# EasyEDA schematic 1-Schematic_EMWAVER_V1.1.json
TITLE: Sheet_1; REV: 1.0; Date: 2022-12-25; Sheet: 1/1; Drawn By: maarnotto; Company: Your Company
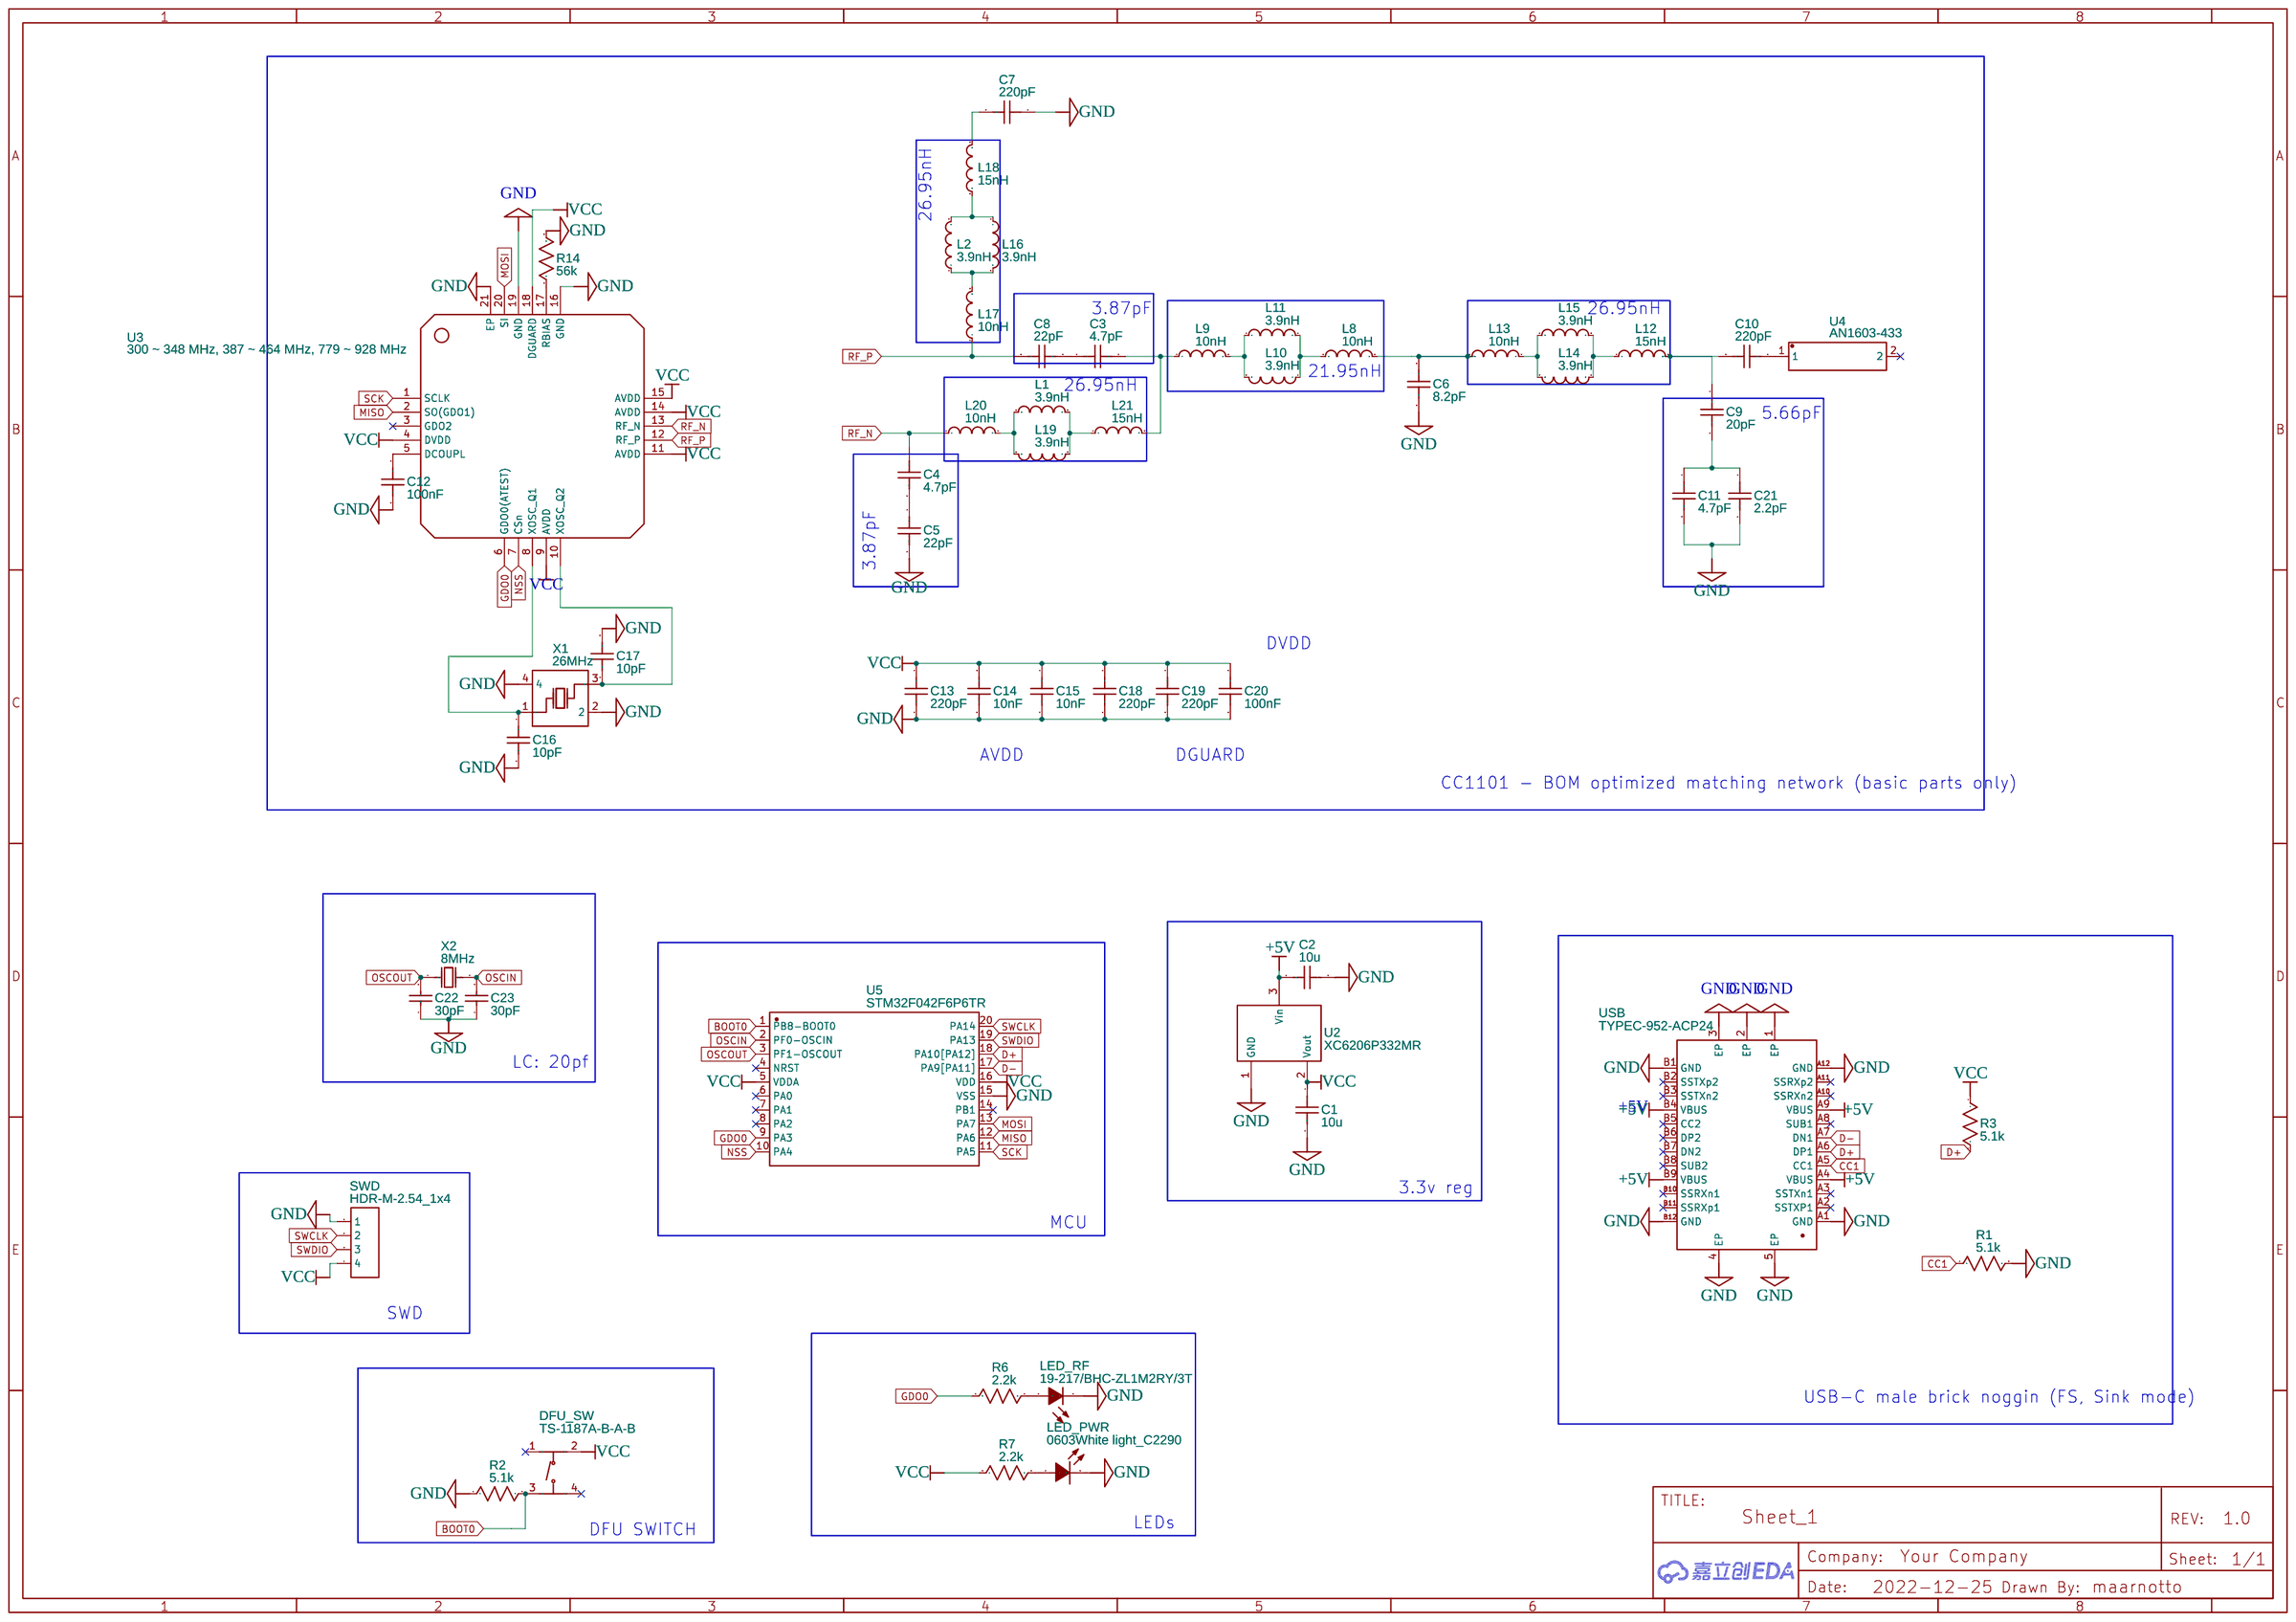
[diagram p0: schematic sheet]

## Parts
C1  10u  [C0603]
C2  10u  [C0603]
C3  4.7pF  [C0402]
C4  4.7pF  [C0402]
C5  22pF  [C0402]
C6  8.2pF  [C0603]
C7  220pF  [C0402]
C8  22pF  [C0402]
C9  20pF  [C0402]
C10  220pF  [C0402]
C11  4.7pF  [C0402]
C12  100nF  [C0402]
C13  220pF  [C0402]
C14  10nF  [C0402]
C15  10nF  [C0402]
C16  10pF  [C0402]
C17  10pF  [C0402]
C18  220pF  [C0402]
C19  220pF  [C0402]
C20  100nF  [C0402]
C21  2.2pF  [C0402]
C22  30pF  [C0603]
C23  30pF  [C0603]
DFU_SW  TS-1187A-B-A-B  [SW-SMD_4P-L5.1-W5.1-P3.70-LS6.5-TL-2]
L1  3.9nH  [L0402]
L2  3.9nH  [L0402]
L8  10nH  [L0402]
L9  10nH  [L0402]
L10  3.9nH  [L0402]
L11  3.9nH  [L0402]
L12  15nH  [L0402]
L13  10nH  [L0402]
L14  3.9nH  [L0402]
L15  3.9nH  [L0402]
L16  3.9nH  [L0402]
L17  10nH  [L0402]
L18  15nH  [L0402]
L19  3.9nH  [L0402]
L20  10nH  [L0402]
L21  15nH  [L0402]
LED_PWR  0603White light_C2290  [LED0603-R-RD_WHITE]
LED_RF  19-217/BHC-ZL1M2RY/3T  [LED0603-RD]
R1  5.1k  [R0603]
R2  5.1k  [R0603]
R3  5.1k  [R0603]
R6  2.2k  [R0603]
R7  2.2k  [R0603]
R14  56k  [R0402]
SWD  HDR-M-2.54_1x4  [HDR-M-2.54_1X4]
U2  XC6206P332MR  [SOT-23-3_L2.9-W1.6-P1.90-LS2.8-BR]
U3  300 ~ 348 MHz, 387 ~ 464 MHz, 779 ~ 928 MHz  [QFN-20_L4.0-W4.0-P0.5-TL-EP]
U4  AN1603-433  [ANT-SMD_L16.0-W3.1]
U5  STM32F042F6P6TR  [TSSOP-20_L6.5-W4.4-P0.65-LS6.4-BL]
USB  TYPEC-952-ACP24  [USB-C-SMD_TYPEC-952-ACP24]
X1  26MHz  [CRYSTAL-SMD_4P-L3.2-W2.5-BL]
X2  8MHz  [CRYSTAL-SMD_L5.0-W3.2]

## Library data of the parts
C1 C2 C6 = C_0603_US: Contributor: LCEDA_Lib
C3-C5 C7-C21 = C_0402_US: Contributor: LCEDA_Lib
C22 C23 = 0603CG300J500NT: Supplier: LCSC; Manufacturer: FH(风华); Supplier Part: C1658; JLCPCB Part Class: Basic Part
DFU_SW = TS-1187A-B-A-B: Supplier: LCSC; Supplier Part: C318884; Manufacturer: XKB Connectivity(中国星坤); Contributor: LCSC; JLCPCB Part Class: Basic Part
L1 L2 L10 L11 L14-L16 L19 = L0402_US: Supplier Part: C14033; Contributor: LCEDA_Lib
L8 L9 L13 L17 L20 = L0402_US: Supplier Part: C27147; Contributor: LCEDA_Lib
L12 L18 L21 = L0402_US: Supplier Part: C27143; Contributor: LCEDA_Lib
LED_PWR = 0603White light_C2290: Supplier: LCSC; Manufacturer: null; Manufacturer Part: KT-0603白灯; Supplier Part: C2290; JLCPCB Part Class: Basic Part
LED_RF = 19-217/BHC-ZL1M2RY/3T: Supplier: LCSC; Manufacturer: EVERLIGHT(亿光); Supplier Part: C72041; JLCPCB Part Class: Basic Part
R1-R3 R6 R7 = R_0603_US: Contributor: LCEDA_Lib
R14 = R_0402_US: Contributor: LCEDA_Lib
SWD = HDR-M-2.54_1x4: Supplier Part: C124378; Supplier: LCSC; Contributor: LCEDA_Lib
U2 = XC6206P332MR: Supplier: LCSC; Manufacturer: TOREX(特瑞仕); Supplier Part: C5446; JLCPCB Part Class: Basic Part
U3 = CC1101RGPR: Supplier: LCSC; Manufacturer: TI(德州仪器); Supplier Part: C29953; JLCPCB Part Class: Extended Part
U4 = AN1603-433: Supplier: LCSC; Supplier Part: C122806; Manufacturer: rainsun(霖昱微); Contributor: LCSC; JLCPCB Part Class: Extended Part
U5 = STM32F042F6P6TR: Supplier: LCSC; Supplier Part: C2969989; Manufacturer: ST(意法半导体); link: https://atta.szlcsc.com/upload/public/pdf/source/20180326/C88048_75CEBEF3F549B3F081FE2DB403271B9C.pdf; Contributor: lcsc; JLCPCB Part Class: Extended Part
USB = TYPEC-952-ACP24: Supplier: LCSC; Supplier Part: C2840398; Manufacturer: XUNPU(讯普); Contributor: LCSC; JLCPCB Part Class: Extended Part
X1 = 3S26000333: Supplier: LCSC; Supplier Part: C431163; Manufacturer: YL(惠伦晶体); Contributor: LCSC; JLCPCB Part Class: Extended Part
X2 = X50328MSB2GI: Supplier: LCSC; Manufacturer: YXC(扬兴晶振); Supplier Part: C115962; JLCPCB Part Class: Basic Part

## Nets
+5V: C2.2 U2.3(Vin) USB.A4(VBUS) USB.A9(VBUS) USB.B4(VBUS) USB.B9(VBUS)
GND: C1.2 C2.1 C5.2 C6.2 C7.1 C11.2 C12.2 C13.2 C14.2 C15.2 C16.2 C17.2 C18.2 C19.2 C20.2 C21.2 C22.1 C23.1 LED_PWR.2(K) LED_RF.1(C) R1.2 R2.1 R14.2 SWD.1 U2.1(GND) U3.16(GND) U3.19(GND) U3.21(EP) U5.15(VSS) USB.1(EP) USB.2(EP) USB.3(EP) USB.4(EP) USB.5(EP) USB.A1(GND) USB.A12(GND) USB.B1(GND) USB.B12(GND) X1.2 X1.4
VCC: C1.1 C13.1 C14.1 C15.1 C18.1 C19.1 C20.1 DFU_SW.2(B) R3.1 R7.1 SWD.4 U2.2(Vout) U3.4(DVDD) U3.9(AVDD) U3.11(AVDD) U3.14(AVDD) U3.15(AVDD) U3.18(DGUARD) U5.5(VDDA) U5.16(VDD)
BOOT0: DFU_SW.3(C) R2.2 U5.1(PB8-BOOT0)
CC1: R1.1 USB.A5(CC1)
D+: R3.2 U5.18(PA10[PA12]) USB.A6(DP1)
D-: U5.17(PA9[PA11]) USB.A7(DN1)
GDO0: R6.1 U3.6(GDO0(ATEST)) U5.9(PA3)
MISO: U3.2(SO(GDO1)) U5.12(PA6)
MOSI: U3.20(SI) U5.13(PA7)
NSS: U3.7(CSn) U5.10(PA4)
OSCIN: C23.2 U5.2(PF0-OSCIN) X2.2(OSC2)
OSCOUT: C22.2 U5.3(PF1-OSCOUT) X2.1(OSC1)
RF_N: C4.1 L20.1 U3.13(RF_N)
RF_P: C8.2 L17.1 U3.12(RF_P)
SCK: U3.1(SCLK) U5.11(PA5)
SWCLK: SWD.2 U5.20(PA14)
SWDIO: SWD.3 U5.19(PA13)
Net-(C3-1): C3.1 L9.1 L21.2
Net-(C3-2): C3.2 C8.1
Net-(C4-2): C4.2 C5.1
Net-(C6-1): C6.1 L8.2 L13.1
Net-(C7-2): C7.2 L18.2
Net-(C9-1): C9.1 C10.2 L12.2
Net-(C9-2): C9.2 C11.1 C21.1
Net-(C10-1): C10.1 U4.1
Net-(C12-1): C12.1 U3.5(DCOUPL)
Net-(C16-1): C16.1 U3.8(XOSC_Q1) X1.1(OSC1)
Net-(C17-1): C17.1 U3.10(XOSC_Q2) X1.3(OSC2)
Net-(L1-1): L1.1 L19.2 L20.2
Net-(L1-2): L1.2 L19.1 L21.1
Net-(L2-1): L2.1 L16.2 L17.2
Net-(L2-2): L2.2 L16.1 L18.1
Net-(L8-1): L8.1 L10.1 L11.2
Net-(L9-2): L9.2 L10.2 L11.1
Net-(L12-1): L12.1 L14.1 L15.2
Net-(L13-2): L13.2 L14.2 L15.1
Net-(LED_PWR-1): LED_PWR.1(A) R7.2
Net-(LED_RF-2): LED_RF.2(A) R6.2
Net-(R14-1): R14.1 U3.17(RBIAS)

Not connected (* = marked no-connect by the designer): DFU_SW 1(A)* 4(D)*; U3 3(GDO2)*; U4 2*; U5 4(NRST)* 6(PA0)* 7(PA1)* 8(PA2)* 14(PB1)*; USB A2(SSTXP1)* A3(SSTXn1)* A8(SUB1)* A10(SSRXn2)* A11(SSRXp2)* B2(SSTXp2)* B3(SSTXn2)* B5(CC2)* B6(DP2)* B7(DN2)* B8(SUB2)* B10(SSRXn1)* B11(SSRXp1)*

## Notes on the sheet
- 26.95nH
- 3.87pF
- 26.95nH
- 21.95nH
- 26.95nH
- 5.66pF
- 3.87pF
- DVDD
- AVDD
- DGUARD
- CC1101 - BOM optimized matching network (basic parts only)
- LC: 20pf
- +5V
- 3.3v reg
- MCU
- SWD
- USB-C male brick noggin (FS, Sink mode)
- DFU SWITCH
- LEDs
